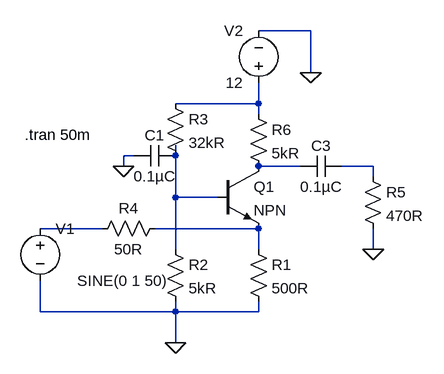
[diagram p0: schematic base_circuit.asc]
base_circuit.asc, the LTspice schematic file:
Version 4
SHEET 1 880 680
WIRE 240 -128 160 -128
WIRE 240 -64 240 -128
WIRE 160 -16 160 -48
WIRE 160 -16 32 -16
WIRE 160 0 160 -16
WIRE -32 64 -48 64
WIRE 32 64 32 48
WIRE -48 80 -48 64
WIRE 224 80 160 80
WIRE 336 80 288 80
WIRE 336 96 336 80
WIRE 32 128 32 64
WIRE 96 128 32 128
WIRE -80 176 -176 176
WIRE 160 176 0 176
WIRE 32 208 32 128
WIRE 160 208 160 176
WIRE 336 208 336 176
WIRE -176 304 -176 256
WIRE 32 304 32 288
WIRE 32 304 -176 304
WIRE 160 304 160 288
WIRE 160 304 32 304
WIRE 32 352 32 304
FLAG 32 352 0
FLAG 240 -64 0
FLAG 336 208 0
FLAG -48 80 0
SYMBOL npn 96 80 R0
SYMATTR InstName Q1
SYMBOL res 144 192 R0
SYMATTR InstName R1
SYMATTR Value 500R
SYMBOL res 16 192 R0
SYMATTR InstName R2
SYMATTR Value 5kR
SYMBOL res 16 -32 R0
SYMATTR InstName R3
SYMATTR Value 32kR
SYMBOL voltage -176 160 R0
WINDOW 123 0 0 Left 0
WINDOW 39 0 0 Left 0
WINDOW 3 57 96 Left 2
SYMATTR Value SINE(0 1 50)
SYMATTR InstName V1
SYMBOL voltage 160 -32 R180
WINDOW 0 24 96 Left 2
WINDOW 3 24 16 Left 2
WINDOW 123 0 0 Left 0
WINDOW 39 0 0 Left 0
SYMATTR InstName V2
SYMATTR Value 12
SYMBOL cap 288 64 R90
WINDOW 0 0 32 VBottom 2
WINDOW 3 32 32 VTop 2
SYMATTR InstName C3
SYMATTR Value 0.1µC
SYMBOL res 320 80 R0
SYMATTR InstName R5
SYMATTR Value 470R
SYMBOL res 16 160 R90
WINDOW 0 0 56 VBottom 2
WINDOW 3 32 56 VTop 2
SYMATTR InstName R4
SYMATTR Value 50R
SYMBOL cap 32 48 R90
WINDOW 0 0 32 VBottom 2
WINDOW 3 32 32 VTop 2
SYMATTR InstName C1
SYMATTR Value 0.1µC
SYMBOL res 144 -16 R0
SYMATTR InstName R6
SYMATTR Value 5kR
TEXT -200 32 Left 2 !.tran 50m

The netlist it stands for:
* base_circuit.asc
Q1 N003 N002 N006 0 NPN
R1 N006 0 500R
R2 N002 0 5kR
R3 N001 N002 32kR
V1 N005 0 SINE(0 1 50)
V2 N001 0 12
C3 N004 N003 0.1µC
R5 N004 0 470R
R4 N006 N005 50R
C1 N002 0 0.1µC
R6 N001 N003 5kR
.model NPN NPN
.model PNP PNP
.lib standard.bjt
.tran 50m
.backanno
.end